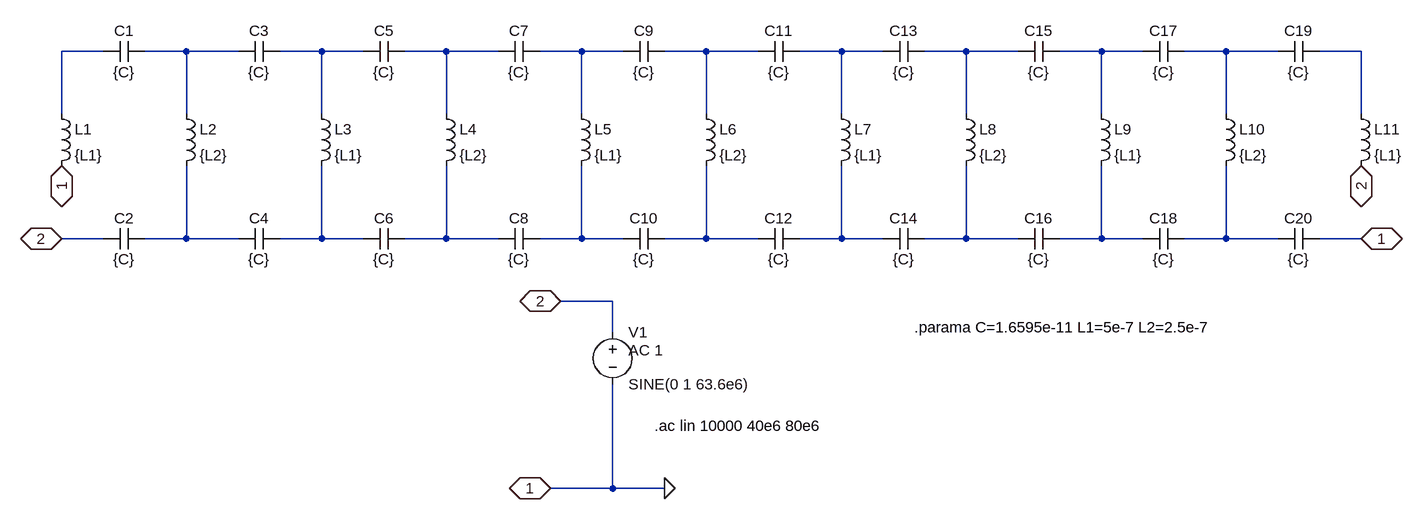
[diagram p0: schematic TMRM sheet.asc]
TMRM sheet.asc, the LTspice schematic file:
Version 4
SHEET 1 3612 984
WIRE -64 240 -128 240
WIRE 64 240 0 240
WIRE 144 240 64 240
WIRE 272 240 208 240
WIRE 336 240 272 240
WIRE 464 240 400 240
WIRE 544 240 464 240
WIRE 672 240 608 240
WIRE 736 240 672 240
WIRE 864 240 800 240
WIRE 944 240 864 240
WIRE 1072 240 1008 240
WIRE 1136 240 1072 240
WIRE 1264 240 1200 240
WIRE 1344 240 1264 240
WIRE 1472 240 1408 240
WIRE 1536 240 1472 240
WIRE 1664 240 1600 240
WIRE 1744 240 1664 240
WIRE 1872 240 1808 240
WIRE -128 336 -128 240
WIRE 64 336 64 240
WIRE 272 336 272 240
WIRE 464 336 464 240
WIRE 672 336 672 240
WIRE 864 336 864 240
WIRE 1072 336 1072 240
WIRE 1264 336 1264 240
WIRE 1472 336 1472 240
WIRE 1664 336 1664 240
WIRE 1872 336 1872 240
WIRE -64 528 -128 528
WIRE 64 528 64 416
WIRE 64 528 0 528
WIRE 144 528 64 528
WIRE 272 528 272 416
WIRE 272 528 208 528
WIRE 336 528 272 528
WIRE 464 528 464 416
WIRE 464 528 400 528
WIRE 544 528 464 528
WIRE 672 528 672 416
WIRE 672 528 608 528
WIRE 736 528 672 528
WIRE 864 528 864 416
WIRE 864 528 800 528
WIRE 944 528 864 528
WIRE 1072 528 1072 416
WIRE 1072 528 1008 528
WIRE 1136 528 1072 528
WIRE 1264 528 1264 416
WIRE 1264 528 1200 528
WIRE 1344 528 1264 528
WIRE 1472 528 1472 416
WIRE 1472 528 1408 528
WIRE 1536 528 1472 528
WIRE 1664 528 1664 416
WIRE 1664 528 1600 528
WIRE 1744 528 1664 528
WIRE 1872 528 1808 528
WIRE 720 624 640 624
WIRE 720 672 720 624
WIRE 720 912 720 752
WIRE 720 912 624 912
WIRE 800 912 720 912
FLAG 800 912 0
FLAG -128 416 1
IOPIN -128 416 BiDir
FLAG 1872 528 1
IOPIN 1872 528 BiDir
FLAG -128 528 2
IOPIN -128 528 BiDir
FLAG 1872 416 2
IOPIN 1872 416 BiDir
FLAG 624 912 1
IOPIN 624 912 BiDir
FLAG 640 624 2
IOPIN 640 624 BiDir
SYMBOL voltage 720 656 R0
WINDOW 123 24 44 Left 2
WINDOW 39 0 0 Left 0
SYMATTR Value2 AC 1
SYMATTR InstName V1
SYMATTR Value SINE(0 1 63.6e6)
SYMBOL cap 0 224 R90
WINDOW 0 0 32 VBottom 2
WINDOW 3 32 32 VTop 2
SYMATTR InstName C1
SYMATTR Value {C}
SYMBOL cap 0 512 R90
WINDOW 0 0 32 VBottom 2
WINDOW 3 32 32 VTop 2
SYMATTR InstName C2
SYMATTR Value {C}
SYMBOL ind -144 320 R0
SYMATTR InstName L1
SYMATTR Value {L1}
SYMBOL ind 48 320 R0
SYMATTR InstName L2
SYMATTR Value {L2}
SYMBOL cap 208 224 R90
WINDOW 0 0 32 VBottom 2
WINDOW 3 32 32 VTop 2
SYMATTR InstName C3
SYMATTR Value {C}
SYMBOL cap 208 512 R90
WINDOW 0 0 32 VBottom 2
WINDOW 3 32 32 VTop 2
SYMATTR InstName C4
SYMATTR Value {C}
SYMBOL ind 256 320 R0
SYMATTR InstName L3
SYMATTR Value {L1}
SYMBOL cap 400 224 R90
WINDOW 0 0 32 VBottom 2
WINDOW 3 32 32 VTop 2
SYMATTR InstName C5
SYMATTR Value {C}
SYMBOL cap 400 512 R90
WINDOW 0 0 32 VBottom 2
WINDOW 3 32 32 VTop 2
SYMATTR InstName C6
SYMATTR Value {C}
SYMBOL ind 448 320 R0
SYMATTR InstName L4
SYMATTR Value {L2}
SYMBOL cap 608 224 R90
WINDOW 0 0 32 VBottom 2
WINDOW 3 32 32 VTop 2
SYMATTR InstName C7
SYMATTR Value {C}
SYMBOL cap 608 512 R90
WINDOW 0 0 32 VBottom 2
WINDOW 3 32 32 VTop 2
SYMATTR InstName C8
SYMATTR Value {C}
SYMBOL ind 656 320 R0
SYMATTR InstName L5
SYMATTR Value {L1}
SYMBOL cap 800 224 R90
WINDOW 0 0 32 VBottom 2
WINDOW 3 32 32 VTop 2
SYMATTR InstName C9
SYMATTR Value {C}
SYMBOL cap 800 512 R90
WINDOW 0 0 32 VBottom 2
WINDOW 3 32 32 VTop 2
SYMATTR InstName C10
SYMATTR Value {C}
SYMBOL ind 848 320 R0
SYMATTR InstName L6
SYMATTR Value {L2}
SYMBOL cap 1008 224 R90
WINDOW 0 0 32 VBottom 2
WINDOW 3 32 32 VTop 2
SYMATTR InstName C11
SYMATTR Value {C}
SYMBOL cap 1008 512 R90
WINDOW 0 0 32 VBottom 2
WINDOW 3 32 32 VTop 2
SYMATTR InstName C12
SYMATTR Value {C}
SYMBOL ind 1056 320 R0
SYMATTR InstName L7
SYMATTR Value {L1}
SYMBOL cap 1200 224 R90
WINDOW 0 0 32 VBottom 2
WINDOW 3 32 32 VTop 2
SYMATTR InstName C13
SYMATTR Value {C}
SYMBOL cap 1200 512 R90
WINDOW 0 0 32 VBottom 2
WINDOW 3 32 32 VTop 2
SYMATTR InstName C14
SYMATTR Value {C}
SYMBOL ind 1248 320 R0
SYMATTR InstName L8
SYMATTR Value {L2}
SYMBOL cap 1408 224 R90
WINDOW 0 0 32 VBottom 2
WINDOW 3 32 32 VTop 2
SYMATTR InstName C15
SYMATTR Value {C}
SYMBOL cap 1408 512 R90
WINDOW 0 0 32 VBottom 2
WINDOW 3 32 32 VTop 2
SYMATTR InstName C16
SYMATTR Value {C}
SYMBOL ind 1456 320 R0
SYMATTR InstName L9
SYMATTR Value {L1}
SYMBOL cap 1600 224 R90
WINDOW 0 0 32 VBottom 2
WINDOW 3 32 32 VTop 2
SYMATTR InstName C17
SYMATTR Value {C}
SYMBOL cap 1600 512 R90
WINDOW 0 0 32 VBottom 2
WINDOW 3 32 32 VTop 2
SYMATTR InstName C18
SYMATTR Value {C}
SYMBOL ind 1648 320 R0
SYMATTR InstName L10
SYMATTR Value {L2}
SYMBOL cap 1808 224 R90
WINDOW 0 0 32 VBottom 2
WINDOW 3 32 32 VTop 2
SYMATTR InstName C19
SYMATTR Value {C}
SYMBOL cap 1808 512 R90
WINDOW 0 0 32 VBottom 2
WINDOW 3 32 32 VTop 2
SYMATTR InstName C20
SYMATTR Value {C}
SYMBOL ind 1856 320 R0
SYMATTR InstName L11
SYMATTR Value {L1}
TEXT 784 816 Left 2 !.ac lin 10000 40e6 80e6
TEXT 1184 664 Left 2 !.parama C=1.6595e-11 L1=5e-7 L2=2.5e-7

The netlist it stands for:
* TMRM sheet.asc
V1 2 0 SINE(0 1 63.6e6) AC 1
C1 N002 N001 {C}
C2 N012 2 {C}
L1 N001 0 {L1}
L2 N002 N012 {L2}
C3 N003 N002 {C}
C4 N013 N012 {C}
L3 N003 N013 {L1}
C5 N004 N003 {C}
C6 N014 N013 {C}
L4 N004 N014 {L2}
C7 N005 N004 {C}
C8 N015 N014 {C}
L5 N005 N015 {L1}
C9 N006 N005 {C}
C10 N016 N015 {C}
L6 N006 N016 {L2}
C11 N007 N006 {C}
C12 N017 N016 {C}
L7 N007 N017 {L1}
C13 N008 N007 {C}
C14 N018 N017 {C}
L8 N008 N018 {L2}
C15 N009 N008 {C}
C16 N019 N018 {C}
L9 N009 N019 {L1}
C17 N010 N009 {C}
C18 N020 N019 {C}
L10 N010 N020 {L2}
C19 N011 N010 {C}
C20 0 N020 {C}
L11 N011 2 {L1}
.ac lin 10000 40e6 80e6
.parama C=1.6595e-11 L1=5e-7 L2=2.5e-7
.backanno
.end